# Altium schematic sheet main_board.SchDoc
size 420 x 297 mm; SheetNumber: 1; SheetTotal: 1
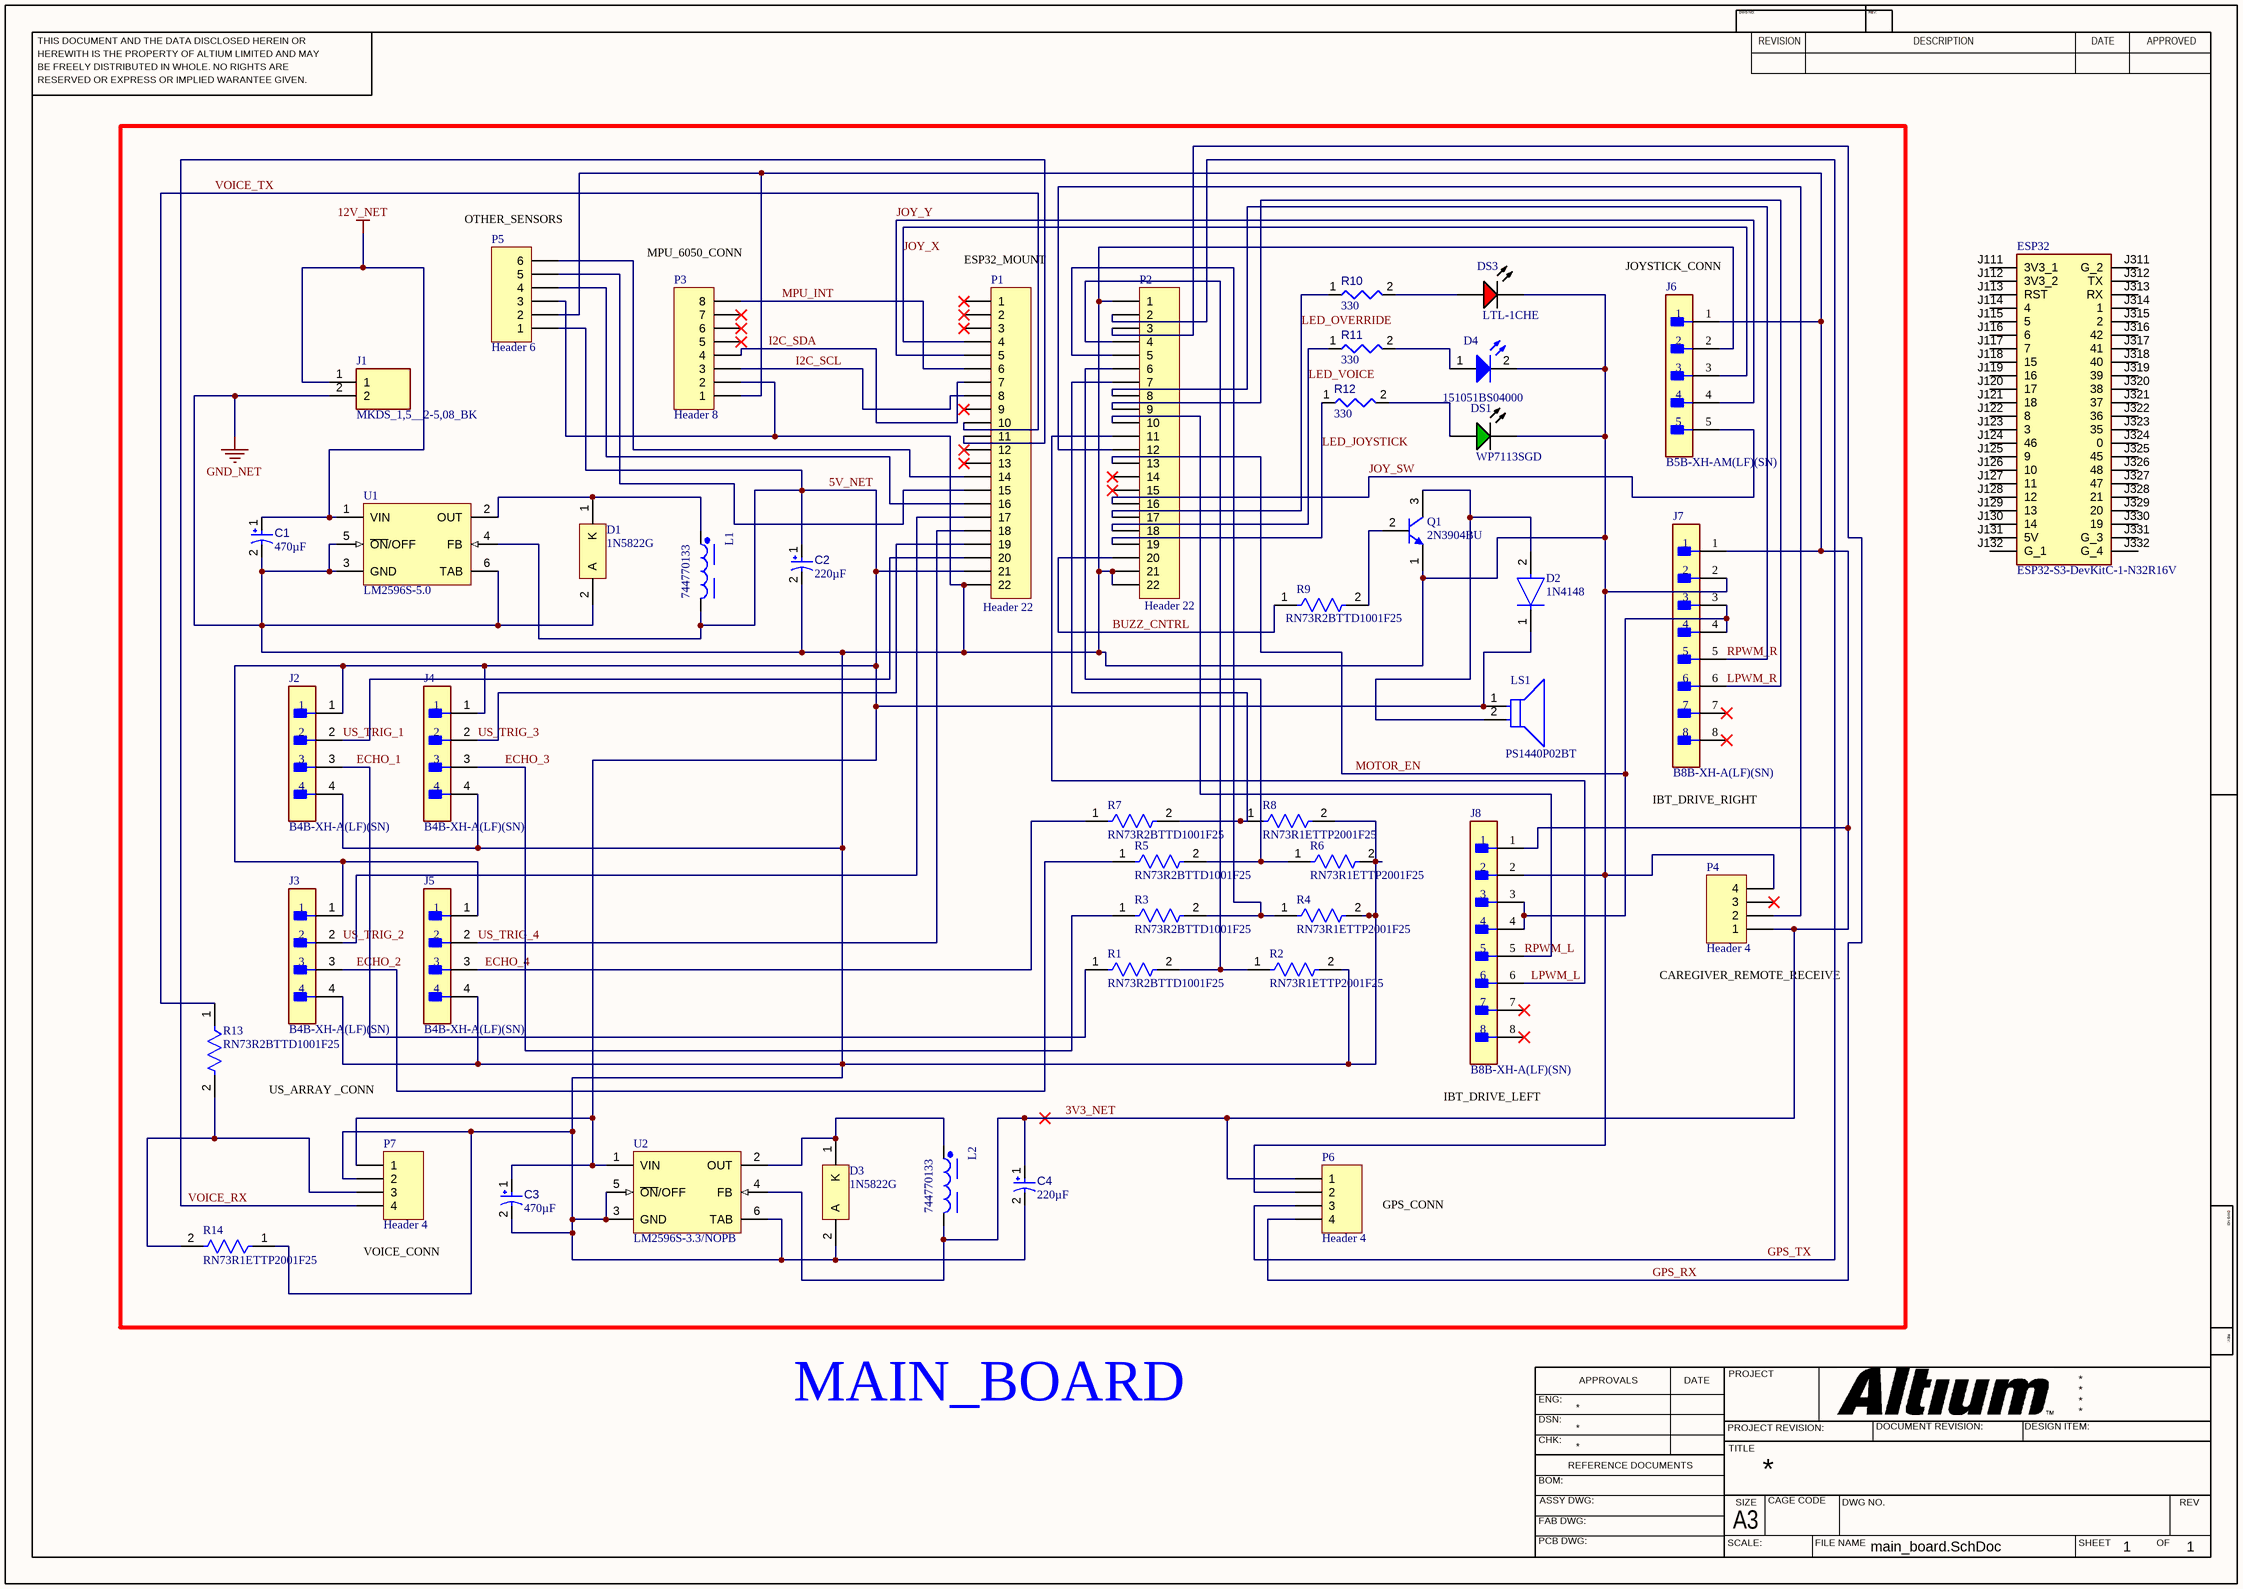
[diagram p0: main_board.SchDoc]

## Parts
C1  value 470µF  [CAPPR65-500-2000X1000X2200]  (hidden comment: ECA-1HM471)
C2  value 220µF  [CAPPR65-500-2000X1000X2200]  (hidden comment: ECA-1HM471)
C3  value 470µF  [CAPPR65-500-2000X1000X2200]  (hidden comment: ECA-1HM471)
C4  value 220µF  [CAPPR65-500-2000X1000X2200]  (hidden comment: ECA-1HM471)
D1  1N5822G  [ONSC-AXIAL_LEAD-2-267-05_V]
D2  1N4148  [FP-017AG-MFG]
D3  1N5822G  [ONSC-AXIAL_LEAD-2-267-05_V]
D4  151051BS04000  [WL-TMRC_D5.9H8.7]
DS1  WP7113SGD  [KING-WP7113SGD_V]
DS3  LTL-1CHE  [INDPR60-254-520X380X650]
ESP32  ESP32-S3-DevKitC-1-N32R16V  [ESP32S3DevKitC1N32R16V]
J1  MKDS_1,5__2-5,08_BK  [MKDS152508BK]
J2  B4B-XH-A(LF)(SN)  [FP-B4B-XH-A_LF_SN-MFG]
J3  B4B-XH-A(LF)(SN)  [FP-B4B-XH-A_LF_SN-MFG]
J4  B4B-XH-A(LF)(SN)  [FP-B4B-XH-A_LF_SN-MFG]
J5  B4B-XH-A(LF)(SN)  [FP-B4B-XH-A_LF_SN-MFG]
J6  B5B-XH-AM(LF)(SN)  [FP-B5B-XH-AM_LF_SN-MFG]
J7  B8B-XH-A(LF)(SN)  [FP-B8B-XH-A_LF_SN-MFG]
J8  B8B-XH-A(LF)(SN)  [FP-B8B-XH-A_LF_SN-MFG]
L1  744770133  [WE-PD_1280]
L2  744770133  [WE-PD_1280]
LS1  PS1440P02BT  [FP-PS1440P02BT-MFG]
P1  Header 22  [HDR1X22]
P2  Header 22  [HDR1X22]
P3  Header 8  [HDR1X8]
P4  Header 4  [HDR1X4]
P5  Header 6  [HDR1X6]
P6  Header 4  [HDR1X4]
P7  Header 4  [HDR1X4]
Q1  2N3904BU  [FAIR-TO-92]
R1  RN73R2BTTD1001F25  [FP-RN73R2B-MFG]
R2  RN73R1ETTP2001F25  [FP-RN73R1E-IPC_B]
R3  RN73R2BTTD1001F25  [FP-RN73R2B-MFG]
R4  RN73R1ETTP2001F25  [FP-RN73R1E-IPC_B]
R5  RN73R2BTTD1001F25  [FP-RN73R2B-MFG]
R6  RN73R1ETTP2001F25  [FP-RN73R1E-IPC_B]
R7  RN73R2BTTD1001F25  [FP-RN73R2B-MFG]
R8  RN73R1ETTP2001F25  [FP-RN73R1E-IPC_B]
R9  RN73R2BTTD1001F25  [FP-RN73R2B-MFG]
R10  value 330  [RESC0402(1005)_L]  (hidden comment: Resistor 330R +/-5 % 0402 63 mW)
R11  value 330  [RESC0402(1005)_L]  (hidden comment: Resistor 330R +/-5 % 0402 63 mW)
R12  value 330  [RESC0402(1005)_L]  (hidden comment: Resistor 330R +/-5 % 0402 63 mW)
R13  RN73R2BTTD1001F25  [FP-RN73R2B-MFG]
R14  RN73R1ETTP2001F25  [FP-RN73R1E-IPC_B]
U1  LM2596S-5.0  [KTT0005B_L]
U2  LM2596S-3.3/NOPB  [KTT0005B_M]

## Nets
12V_NET: C1.1 J1.1 U1.1(VIN)
GND_NET: C1.2 C2.2 C3.2 C4.2 D1.2(A) D3.2(A) D4.2(K) DS1.2(K) DS3.2(K) J1.2 J2.4 J3.4 J4.4 J5.4 J6.2 J7.2 J8.2 P1.22 P2.1 P2.21 P2.22 P3.2 P4.4 P5.3 P6.2 P7.2 Q1.1(E) R2.2 R4.2 R6.2 R8.2 R14.1 U1.3(GND) U1.5(~{ON}/OFF) U1.6(TAB) U2.3(GND) U2.5(~{ON}/OFF) U2.6(TAB)
3V3_NET: C4.1 J6.1 J7.1 J8.1 L2.2 P3.1 P4.1 P5.2 P6.1 U2.4(FB)
5V_NET: C2.1 C3.1 D2.1(C) J2.1 J3.1 J4.1 J5.1 L1.2 LS1.1 P1.21 P5.1 P7.1 U1.4(FB) U2.1(VIN)
BUZZ_CNTRL: P2.20 R9.1
ECHO_1: J2.3 R1.1
ECHO_2: J3.3 R5.1
ECHO_3: J4.3 R3.1
ECHO_4: J5.3 R7.1
GPS_RX: P2.3 P6.4
GPS_TX: P2.2 P6.3
I2C_SCL: P1.8 P3.3
I2C_SDA: P1.7 P3.4
JOY_SW: J6.5 P2.16
JOY_X: J6.3 P1.4
JOY_Y: J6.4 P1.5
LED_JOYSTICK: P2.19 R12.1
LED_OVERRIDE: P2.17 R10.1
LED_VOICE: P2.18 R11.1
LPWM_L: J8.6 P2.11
LPWM_R: J7.6 P2.9
MOTOR_EN: J7.3 J7.4 J8.3 J8.4 P2.13
MPU_INT: P1.6 P3.8
RPWM_L: J8.5 P2.10
RPWM_R: J7.5 P2.8
US_TRIG_1: J2.2 P1.20
US_TRIG_2: J3.2 P1.17
US_TRIG_3: J4.2 P1.19
US_TRIG_4: J5.2 P1.18
VOICE_RX: P1.11 P7.4
VOICE_TX: P1.10 R13.1
NetD1_1: D1.1(K) L1.1 U1.2(OUT)
NetD2_2: D2.2(A) LS1.2 Q1.3(C)
NetD3_1: D3.1(K) L2.1 U2.2(OUT)
NetD4_1: D4.1(A) R11.2
NetDS1_1: DS1.1(A) R12.2
NetDS3_1: DS3.1(A) R10.2
NetP1_14: P1.14 P5.6
NetP1_15: P1.15 P5.5
NetP1_16: P1.16 P5.4
NetP2_4: P2.4 R1.2 R2.1
NetP2_5: P2.5 R3.2 R4.1
NetP2_6: P2.6 R5.2 R6.1
NetP2_7: P2.7 R7.2 R8.1
NetP2_12: P2.12 P4.2
NetP7_3: P7.3 R13.2 R14.2
NetQ1_2: Q1.2(B) R9.2

Not connected (* = marked no-connect by the designer): ESP32 J111(3V3_1) J112(3V3_2) J113(RST) J114(4) J115(5) J116(6) J117(7) J118(15) J119(16) J120(17) J121(18) J122(8) J123(3) J124(46) J125(9) J126(10) J127(11) J128(12) J129(13) J130(14) J131(5V) J132(G_1) J311(G_2) J312(TX) J313(RX) J314(1) J315(2) J316(42) J317(41) J318(40) J319(39) J320(38) J321(37) J322(36) J323(35) J324(0) J325(45) J326(48) J327(47) J328(21) J329(20) J330(19) J331(G_3) J332(G_4); J7 7* 8*; J8 7* 8*; P1 1* 2* 3* 9* 12* 13*; P2 14* 15*; P3 5* 6* 7*; P4 3*

## Notes on the sheet
- (near P5) OTHER_SENSORS
- (near P3) MPU_6050_CONN
- (near P1) ESP32_MOUNT
- (near J6) JOYSTICK_CONN
- IBT_DRIVE_RIGHT
- (near P4) CAREGIVER_REMOTE_RECEIVE
- US_ARRAY _CONN
- IBT_DRIVE_LEFT
- GPS_CONN
- (near P7) VOICE_CONN
- MAIN_BOARD
- THIS DOCUMENT AND THE DATA DISCLOSED HEREIN OR
- HEREWITH IS THE PROPERTY OF ALTIUM LIMITED AND MAY
- DWG NO:
- REVISION
- REV:
- DESCRIPTION
- DATE
- APPROVED
- BE FREELY DISTRIBUTED IN WHOLE. NO RIGHTS ARE
- RESERVED OR EXPRESS OR IMPLIED WARANTEE GIVEN.
- ENG:
- APPROVALS
- PROJECT
- DSN:
- CHK:
- REFERENCE DOCUMENTS
- PROJECT REVISION:
- TITLE
- DOCUMENT REVISION:
- DESIGN ITEM:
- BOM:
- FAB DWG:
- PCB DWG:
- ASSY DWG:
- SCALE:
- A3
- SIZE
- CAGE CODE
- FILE NAME
- DWG NO.
- SHEET
- OF
- REV

## Library data of the parts
C1-C4 = CMP-001-00032-8: Aluminum Electrolytic Capacitor, 470 uF, +/- 20%, 50 V, -40 to 85 degC, 2-Pin THD, RoHS, Bulk; Manufacturer: Panasonic; Ripple Current: 650mA; Voltage Rating: 50V; Ripple Current (AC): 650mA; Packaging: Bulk; Capacitor Type: Electrolytic; Diameter: 10mm; Datasheet URL: http://industrial.panasonic.com/cdbs/www-data/pdf/RDF0000/ABA0000C1047.pdf; Case/Package: Radial; Tolerance: 20%; Max Operating Temperature: 85°C; Pins: 2; Min Operating Temperature: -40°C; RoHS Compliant: True; Mounting Technology: TH; Package Quantity: 200; Lead Pitch: 5mm; Manufacturer URL: http://www.panasonic.com/; Package Description: 2-Pin Radial Lead, Dia 10 mm, Height 22 mm; Datasheet Version: Mar-16; Package Reference: CAPPR65-500-2000X1000X2200
D1 D3 = CMP-1055-00009-1: Rectifier, 2-Pin Axial_Lead, Pb-Free, Bulk Bag; Manufacturer: On Semiconductor; IFSM Max (A): 80; Configuration: Single; ComponentLink3URL: http://www.onsemi.com/pub_link/Collateral/267-05.PDF; PackageDescription: 2-Pin, Axial Lead, Diameter 5.05 mm; ComponentLink1URL: http://www.onsemi.com/; DatasheetVersion: Rev. 10; ComponentLink2Description: Datasheet; ComponentLink3Description: Package Specification; PartNumber: 1N5822G; PackageReference: AXIAL_LEAD-2-267-05; Mounting Technology: Through Hole; ComponentLink1Description: Manufacturer URL; RoHS: TRUE; Packing: Bulk Bag; PackageVersion: Rev. G, 06/2000; ComponentLink2URL: http://www.onsemi.cn/pub_link/Collateral/1N5820-D.PDF
D2 = CMP-07163-000046-1: DIODE GEN PURP 100V 200MA DO35; Forward Voltage: 1V; Max Power Dissipation: 500mW; Max Reverse Current: 5uA; Forward Current: 300mA; Current: 4A; Reverse Recovery Time: 4ns; Element Configuration: Single; Outside Diameter: 1.85mm; Capacitance: 4pF; Polarity: Standard; Max Forward Surge Current (Ifsm): 1A; Reverse Voltage: 100V; Output Current: 200mA; Average Rectified Current: 200mA; Diameter: 1.91mm; Max Repetitive Reverse Voltage (Vrrm): 100V; Current Rating: 200mA; Case/Package: DO-35; Lead Free: Lead Free; Number of Pins: 2; Recovery Time: 4ns; Packaging: Bulk; Contact Plating: Tin; Voltage: 100V; Mount: Through Hole; Max Surge Current: 4A; Package Quantity: 2000; Width: 1.91mm; Max Reverse Voltage (DC): 100V; Length: 4.56mm; Radiation Hardening: No; Power Dissipation: 500mW; Voltage Rating (DC): 100V; Peak Non-Repetitive Surge Current: 4A; REACH SVHC: No SVHC; Height: 4.56mm; Max Operating Temperature: 175°C; Series: -; Weight: 0.01lb; Min Operating Temperature: -65°C
D4 = CMP-1488-00009-3: Single Color LED, Blue, Diffused, T-1 3/4, 4.9mm; Manufacturer Lifecycle Status: ACTIVE; YEOL: 1 = Estimated lifetime > 10 years; Forward Current: 100mA; Viewing Angle: 40°; Max Reverse Voltage (DC): 5V; Forward Voltage: 3.2V; Lens Size: 5mm; Wavelength: 470nm; Test Current: 20mA; Peak Wavelength: 465nm; Luminous Intensity: 500mcd; Lens Style: Circular, Diffused, Round; Case/Package: Radial; RoHS: Compliant; Width: 5mm; REACH SVHC: Unknown; Max Operating Temperature: 85°C; Mount: Through Hole; Height: 8.6mm; Length: 5mm; Min Operating Temperature: -40°C; Lifecycle Status: Production; Dominant Wavelength: 470nm; Packaging: Bulk; Color: Blue
DS1 = CMP-007-00010-2: LED Green, 62.5 mW, 25 mA, -40 to 85 degC, 2-Pin THD, RoHS, Bulk; Manufacturer: Kingbright; Lens Style: Dome; Nominal Vf: 2.2V; Power: 62.5mW; Luminous Intensity: 40mcd; Viewing Angle: 30degrees; Datasheet URL: http://www.kingbrightusa.com/images/catalog/SPEC/WP7113SGD.pdf; Datasheet Version: Rev. 6B, 01/2015; Illumination Colour: Green; Package Quantity: 1000; Package Description: 2-Pin Through Hole Device, Dia 5.9 mm, Body Length 8.6 mm; Colour: Green; Case/Package: Radial; RoHS Compliant: True; Package Reference: WP7113SGD; Mounting Technology: TH; Packaging: Bulk; Forward Voltage: 2.2V
DS3 = CMP-007-00018-2: LED Uni-Color Red, 100 mW, 30 mA, -55 to 100 degC, 2-Pin THD, RoHS, Bulk; Manufacturer: Lite-On; Forward Current: 20mA; Nominal Vf: 2V; Viewing Angle: 60degrees; Luminous Intensity: 12.6mcd; Lens Style: Dome; Pins: 2; RoHS Compliant: True; Package Reference: LTL-1CHE; Package Quantity: 1000; Mounting Technology: TH; Min Operating Temperature: -55°C; Colour: Red; Case/Package: Radial; Manufacturer URL: http://www.us.liteon.com/; Datasheet URL: https://datasheet.ciiva.com/15117/getdatasheetpartid-187746-15117985.pdf; Forward Voltage: 2V; Max Operating Temperature: 100°C; Illumination Colour: Red; Package Description: 2-Pin Through Hole Device, Dia 3.8 mm, Pitch 2.54 mm; Packaging: Bulk; Datasheet Version: Dec-03
ESP32 = ESP32-S3-DevKitC-1-N32R16V: Undefined or Miscellaneous; Manufacturer_Name: Espressif Systems; Datasheet Link: https://docs.espressif.com/projects/esp-dev-kits/en/latest/esp32s3/esp-dev-kits-en-master-esp32s3.pdf; Height: 5mm; Manufacturer_Part_Number: ESP32-S3-DevKitC-1-N32R16V; Mouser Part Number: 356-32S3DKTC1N32R16V; Mouser Price/Stock: https://www.mouser.co.uk/ProductDetail/Espressif-Systems/ESP32-S3-DevKitC-1-N32R16V?qs=sqEgtWRSLJ3pTWIVKUeIew%3D%3D
J1 = MKDS_1,5__2-5,08_BK: Connector; Manufacturer_Name: Phoenix Contact; Manufacturer_Part_Number: MKDS 1,5/ 2-5,08 BK; Datasheet Link: https://pxc-crisp-production-platform-cr-s3downloadbucket-1rf23da6xdlmt.s3.eu-west-1.amazonaws.com/7991510?response-content-disposition=inline%3B%20filename%3D%22pxc_1718760_03_03_MKDS-1-5-2-5-08-BK_FAM.pdf%22&X-Amz-Algorithm=AWS4-HMAC-SHA256&X-Amz-Date=2; Height: 13.95mm
J2-J5 = CMP-17439-000250-1: CONN HEADER VERT 4POS 2.5MM; Number of Contacts: 4; Contact Resistance: 20mR; Voltage Rating: 250V; Max Current Rating: 3A; Gender: Male; Wire/Cable Gauge: 22AWG; Mated Stacking Heights: 9.8mm; Insulation Resistance: 1GR; Orientation: Straight; Contact Type: Male Pin; Contact Finish - Mating: TIN; Series: XH; Max Voltage Rating (AC): 250V; Lead Pitch: 2.5mm; Contact Shape: Square; Insulation Color: Natural; Termination: Solder; Lead Free: Lead Free; Voltage Rating (AC): 250V; Number of Rows: 1; Flammability Rating: UL94 V-0; Number of Positions: 4; Max Operating Temperature: 85°C; Package Quantity: 500; Mount: Through Hole; REACH SVHC: No SVHC; Connector Type: Header; Insulation Material: Nylon; Fastening Type: Detent; Min Operating Temperature: -25°C; Housing Color: White; Packaging: Bulk; Contact Plating: Tin; Contact Material: Brass; Max Voltage Rating (DC): 250V; Housing Material: Polyamide; Color: Natural; Material: Polyamide; Pitch: 2.5mm; Depth: 5.75mm; Current Rating: 3A; Length: 12.4mm
J6 = CMP-17439-000304-1: CONN HEADER VERT 5POS 2.5MM; Mated Stacking Heights: 9.8mm; Voltage Rating: 250V; Max Current Rating: 3A; Number of Positions: 5; Contact Resistance: 20mR; Depth: 5.75mm; Connector Type: Header; Color: Green; Insulation Material: Nylon; Contact Plating: Copper; Length: 14.9mm; Fastening Type: Detent; Contact Material: Brass; Number of Rows: 1; Contact Type: Male Pin; Housing Material: Polyamide; Housing Color: White; Lead Free: Lead Free; Max Voltage Rating (AC): 250V; Mount: Through Hole; Contact Shape: Square; Min Operating Temperature: -25°C; Packaging: Bulk; Orientation: Straight; Insulation Color: Natural; Series: XH; Flammability Rating: UL94 V-0; Contact Finish - Mating: TIN; Max Operating Temperature: 85°C; Termination: Solder; Pitch: 2.5mm
J7 J8 = CMP-17438-000015-1: CONN HEADER VERT 8POS 2.5MM; Voltage Rating (AC): 250V; Insulation Resistance: 1GR; Connector Type: Male Pin; Max Current Rating: 3A; Wire/Cable Gauge: 22AWG; Number of Contacts: 8; Contact Resistance: 20mR; Orientation: Straight; Pitch: 2.5mm; Min Operating Temperature: -25°C; Number of Rows: 1; Contact Type: Male Pin; Packaging: Bulk; Lead Free: Lead Free; Max Operating Temperature: 85°C; Housing Material: Polyamide; Voltage Rating: 250V; Series: XH; Mount: Through Hole; Depth: 5.75mm; Contact Material: Brass; Fastening Type: Detent; Color: Natural; Max Voltage Rating (AC): 250V; Number of Positions: 8; Housing Color: White; Contact Plating: Tin; Lead Pitch: 2.5mm; Length: 22.4mm; REACH SVHC: No SVHC; Termination: Press-Fit; Current Rating: 3A
L1 L2 = CMP-0227-00200-3: Power Choke Shielded Wirewound 33uH 20% 1KHz Ferrite 3.2A 64mOhm DCR T/R; Inductance: 33µH; Saturation Current: 3.6A; Series Resistance: 64mΩ; Self Resonant Frequency: 8.5MHz; DC Resistance (DCR): 44mΩ; Max DC Current: 3.2A; Number of Pins: 2; Max Operating Temperature: 125°C; Tolerance: 20%; Height - Seated (Max): 8.001mm; Core Material: Ferrite; Length: 12mm; Ambient Temperature Range High: 85°C; Width: 12mm; RMS Current (Irms): 3.2A; Shielding: Shielded; Case/Package: Nonstandard; Depth: 12mm; Test Frequency: 1kHz; Composition: Wirewound; Current Rating: 3.6A; Termination: SMD/SMT; Height: 8mm; REACH SVHC: Unknown; Inductance Tolerance: 20%; Ambient Temperature Range Low: -40°C; Mount: Surface Mount; Lead Pitch: 7mm; Min Operating Temperature: -40°C; RoHS: Compliant
LS1 = CMP-08413-000003-1: AUDIO PIEZO TRANSDUCER 30V TH; Self Resonant Frequency: 4kHz; Washable: No; Voltage Rating (DC): 3V; Number of Terminals/Pins: 2; Packaging: Tape and Reel; Lead Free: Lead Free; Min Operating Temperature: -10°C; Package Quantity: 350; Termination: PC Pins; Mount: Through Hole; Max Operating Temperature: 70°C; Operating Supply Voltage: 3V; Diameter: 14mm; RoHS Compliant: Yes; Frequency: 4kHz; Height: 8mm
P1 P2 = CMP-002-00146-1: Header, 22-Pin; Signal Integrity: Connector; LatestRevisionNote: Re-released for DXP Platform.; Source: Miscellaneous Connectors.SchLib; Component Type: Standard; LatestRevisionDate: 17-Jul-2002; Publisher: Altium Limited; Pins: 22; Design Item ID: Header 22
P3 = CMP-002-00188-1: Header, 8-Pin; Signal Integrity: Connector; Design Item ID: Header 8; Pins: 8; LatestRevisionDate: 17-Jul-2002; Component Type: Standard; Publisher: Altium Limited; Source: Miscellaneous Connectors.SchLib; LatestRevisionNote: Re-released for DXP Platform.
P4 P6 P7 = CMP-002-00168-1: Header, 4-Pin; Signal Integrity: Connector; Design Item ID: Header 4; LatestRevisionNote: Re-released for DXP Platform.; Pins: 4; Source: Miscellaneous Connectors.SchLib; Publisher: Altium Limited; LatestRevisionDate: 17-Jul-2002; Component Type: Standard
P5 = CMP-002-00178-1: Header, 6-Pin; Signal Integrity: Connector; Component Type: Standard; Publisher: Altium Limited; Design Item ID: Header 6; Pins: 6; LatestRevisionDate: 17-Jul-2002; Source: Miscellaneous Connectors.SchLib; LatestRevisionNote: Re-released for DXP Platform.
Q1 = CMP-2000-04944-1: NPN General-Purpose Amplifier, 40 V VCEO, 0.2 A, -55 to 150 degC, 2-Pin TO-92, RoHS, Bulk; Manufacturer: FairchildSemiconductor; Maximum Collector Base Voltage: 60V; Minimum DC Current Gain: 40@0.1mA@1V; Maximum Collector Emitter Voltage: 40V; Maximum DC Collector Current: 0.2A; Rad Hard: No; Maximum Operating Frequency: 300(Min)MHz; Maximum Collector Emitter Saturation Voltage: 0.2@1mA@10mA; Maximum Power Dissipation: 625mW; Package Description: 3-Pin Transistor Outline Package, Body Dia 4.79 mm, Pitch 1.27 mm; Package Reference: TO-92; Pin Count: 3; Operating Temperature: -55to150degC; Category: GPBJT; Manufacturer URL: https://www.fairchildsemi.com/; Datasheet URL: https://datasheet.ciiva.com/4722/2n3904-82270-4722369.pdf; Package: 3TO-92; Packaging: Bulk; Type: NPN; Datasheet Version: Rev. 1.1.0, 10/2014; Mounting: ThroughHole
R1 R3 R5 R7 R9 R13 = CMP-04015-029161-1: 1kΩ ±1% 0.25W, 1/4W Chip Resistor 1206 (3216 Metric) Moisture Resistant Thin Film
R2 R4 R6 R8 R14 = CMP-04015-046600-1: 2kΩ ±1% 0.063W, 1/16W Chip Resistor 0402 (1005 Metric) Moisture Resistant Thin Film
R10-R12 = CMP-009-00132-3: Chip Resistor, 330 Ohms, +/-5 %, 63 mW, -55 to 155 degC, 0402; Power: 63mW; Tolerance: 5%; Pins: 2; Max Operating Temperature: 155°C; Min Operating Temperature: -55°C; Case/Package: 0402
U1 = CMP-0069-00270-3: SIMPLE SWITCHER® Power Converter 150 KHz 3A Step-Down Voltage Regulator, 5-pin TO-263; Manufacturer: Texas Instruments; PowerWise: N; PackageTopMarking: NSUZXYTTE#*LM2596S*-5.0 P+; RoHS: N; Code_JEDEC: MO-169-AB; PackageDescription: TO-263, Molded, .400 x .390 x .180in, 5 Lead, .067in Pitch, Surface Mount; PinCount: 5; PackageReference: KTT0005B; CompType: Switcher; ComponentLink1URL: http://www.ti.com/general/docs/lit/getliterature.tsp?genericPartNumber=LM2596&fileType=pdf; ComponentLink1Description: Datasheet URL
U2 = CMP-0069-00275-3: SIMPLE SWITCHER® Power Converter 150 KHz 3A Step-Down Voltage Regulator, 5-pin TO-263, Pb-Free; Manufacturer: Texas Instruments; PackageTopMarking: NSUZXYTTE#*LM2596S*-3.3 P+; PowerWise: N; RoHS: Y; PackageReference: KTT0005B; PackageDescription: TO-263, Molded, .400 x .390 x .180in, 5 Lead, .067in Pitch, Surface Mount; PinCount: 5; ComponentLink1Description: Datasheet URL; Code_JEDEC: MO-169-AB; ComponentLink1URL: http://www.ti.com/general/docs/lit/getliterature.tsp?genericPartNumber=LM2596&fileType=pdf; CompType: Switcher